# EAGLE design Mabee_DHT11 sensor V1.1 (EAGLE 6.1)
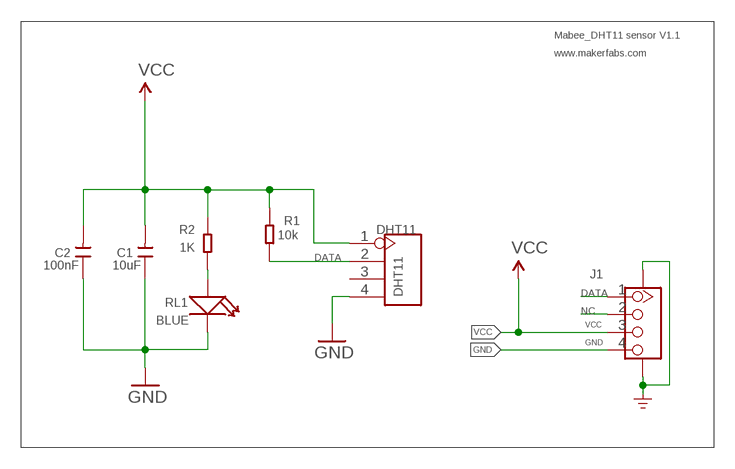
[diagram p0: schematic, sheet 1]

## Parts
C1  10uF  C-0603  [0603]
C2  100nF  C-0603  [0603]
DHT11  DHT11  HEADER-4P-60/35MILROUND  [4P-65/35ROUND]
J1  GROVE-CONNECTOR-SMD'90D'  [HW4-SMD-2.0-90D]
R1  10k  R-0603  [R0603]
R2  1K  R-0603  [R0603]
RL1  BLUE  LED'0603'  [LED-0603]

## Nets
DATA: DHT11.2 J1.1 R1.1
GND: C1.1 C2.1 DHT11.4 J1.4 J1.SS1 J1.SS2 RL1.-
N$3: R2.2 RL1.+
NC: J1.2
VCC: C1.2 C2.2 DHT11.1 J1.3 R1.2 R2.1
Unconnected: DHT11.3

## Notes on the sheet
- Mabee_DHT11 sensor V1.1
- www.makerfabs.com

## Library data of the parts
C1 C2 = Discrete:C*: Ceramic Capacitors
DHT11 = Connector:HEADER-4P
J1 = Connector-new:GROVE-CONNECTOR-SMD: 4P-SMD-2.0:320110030;4P-SMD-2.0-90D:320110032
R1 R2 = Discrete:R*
RL1 = Discrete:LED*

## Net classes
0 default: width 0.152 mm, drill 0.305 mm, clearance 0.152 mm

## Board
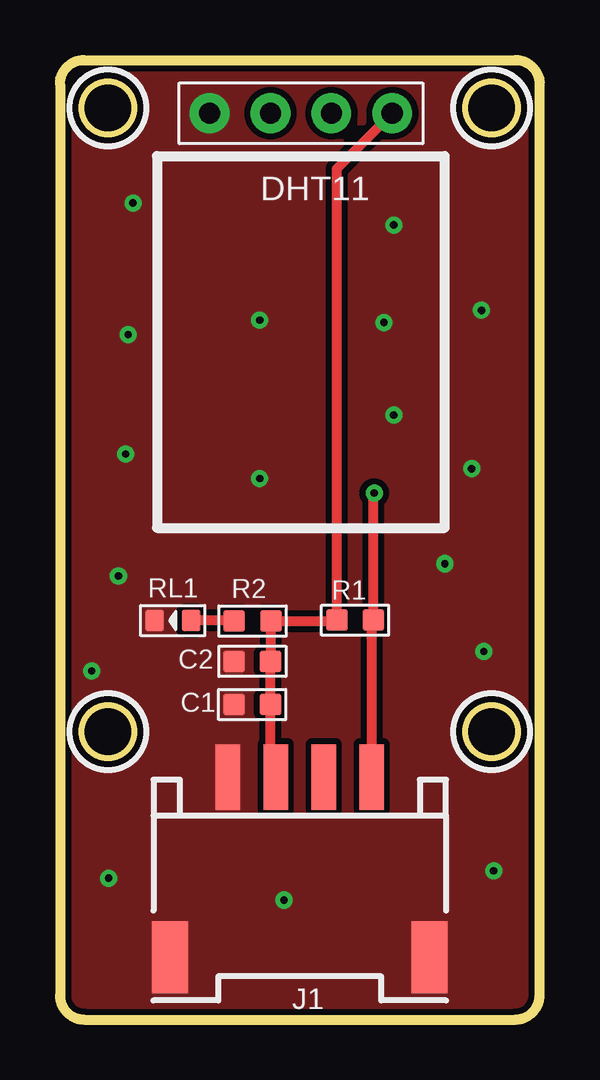
[diagram p1: board, top side]
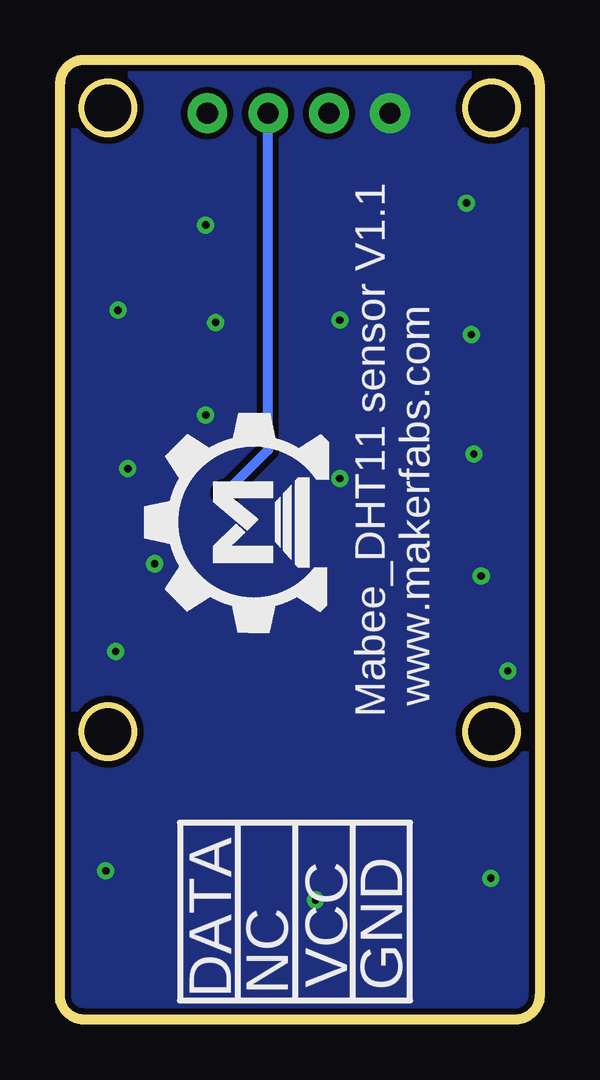
[diagram p2: board, bottom side, seen from below]

Size 20 x 40 mm. Coordinates in mm from the lower left corner, seen from the top.
Outline: 20,1 20,39 arc90 19,40 1,40 arc90 0,39 0,1 arc90 1,0 19,0 arc90 20,1
Outline: circle at 2,12 radius 1.1
Outline: circle at 18,12 radius 1.1
Outline: circle at 2,38 radius 1.1
Outline: circle at 18,38 radius 1.1
Copper layers (1*16): Top 0.035mm / dielectric 1.5mm / Bottom 0.035mm
Design rules: minimum track width 10mil, minimum drill 24mil, track to track 8mil, track to pad 8mil, pad to pad 8mil, via to via 8mil, smd to smd 8mil, copper to edge 10mil, drill to drill 8mil, minimum pad ring 10mil, minimum via ring 8mil, stop-mask expansion 4mil, vias tented up to drill 100mil, thermal gap 0mil

### Footprints (pad centres in the part's own frame; a part is rotated, then mirrored left to right if it is on the bottom)
0603 = smd 0.889 x 0.889: 1 -0.762,0; 2 0.762,0
4P-65/35ROUND = drill 0.889 pad 1.651: 1 0,3.81; 2 0,1.27; 3 0,-1.27; 4 0,-3.81
HW4-SMD-2.0-90D = smd 1.01 x 2.74: 1 -3,-0.1; 2 -1,-0.1; 3 1,-0.1; 4 3,-0.1 | smd 1.5 x 3: SS1 -5.4,7.4; SS2 5.4,7.4
R0603 = smd 0.889 x 0.889: 1 -0.762,0; 2 0.762,0
LED-0603 = smd 0.762 x 0.889: + -0.762,0; - 0.762,0

### Placement (x,y rotation side)
C1  8.02,13.13 0 top
C2  8.03,14.94 0 top
DHT11  10.05,37.78 270 top
J1  10,10 180 top
R1  12.31,16.65 180 top
R2  8.03,16.61 180 top
RL1  4.71,16.63 180 top
U$2  [MAKERFABS_0.3]  8.85,16.61 90 bottom

### Tracks (layer width: path | path; a pad name or v marks a point on that pad's centre or on a via)
DATA  (via drill 0.3)
  Top 0.406: J1.1 13,16.68 R1.1 13.07,21.91 v13.11,21.95
  Bottom 0.406: v13.11,21.95 11.32,23.73 DHT11.2
GND  (via drill 0.3)
  other vias: 2.03,5.89 9.35,4.98 17.68,15.34 18.08,6.2 1.32,14.53 2.44,18.49 16.05,19 17.17,22.96 13.92,25.2 2.74,23.57 8.33,22.56 13.51,29.06 17.58,29.57 8.33,29.16 2.84,28.55 3.05,34.04 13.92,33.12
  pour Top (isolate 0.254, no thermals): -3.76,26.62 -3.76,-1.17 -2.49,-2.44 8.84,-2.44 22.4,-2.44 23.67,-1.17 23.67,26.01 23.67,43.23 22.4,44.5 9.55,44.5 -2.49,44.5 -3.76,43.23
  pour Bottom (isolate 0.254, no thermals): -5.18,23.77 -5.18,-2.39 -3.91,-3.66 9.25,-3.66 23.93,-3.66 25.2,-2.39 25.2,26.62 25.2,44.75 23.93,46.02 10.36,46.02 -3.91,46.02 -5.18,44.75
N$3
  Top 0.406: R2.2 7.25,16.63 RL1.+
VCC
  Top 0.406: J1.3 8.78,10.32 C1.2 8.79,13.14 C2.2 R2.1 11.4,16.61 R1.2 11.55,35.47 DHT11.1

### Text on the board
bPlace: Mabee_DHT11 sensor V1.1 | www.makerfabs.com
bNames: DATA | GND | VCC | NC